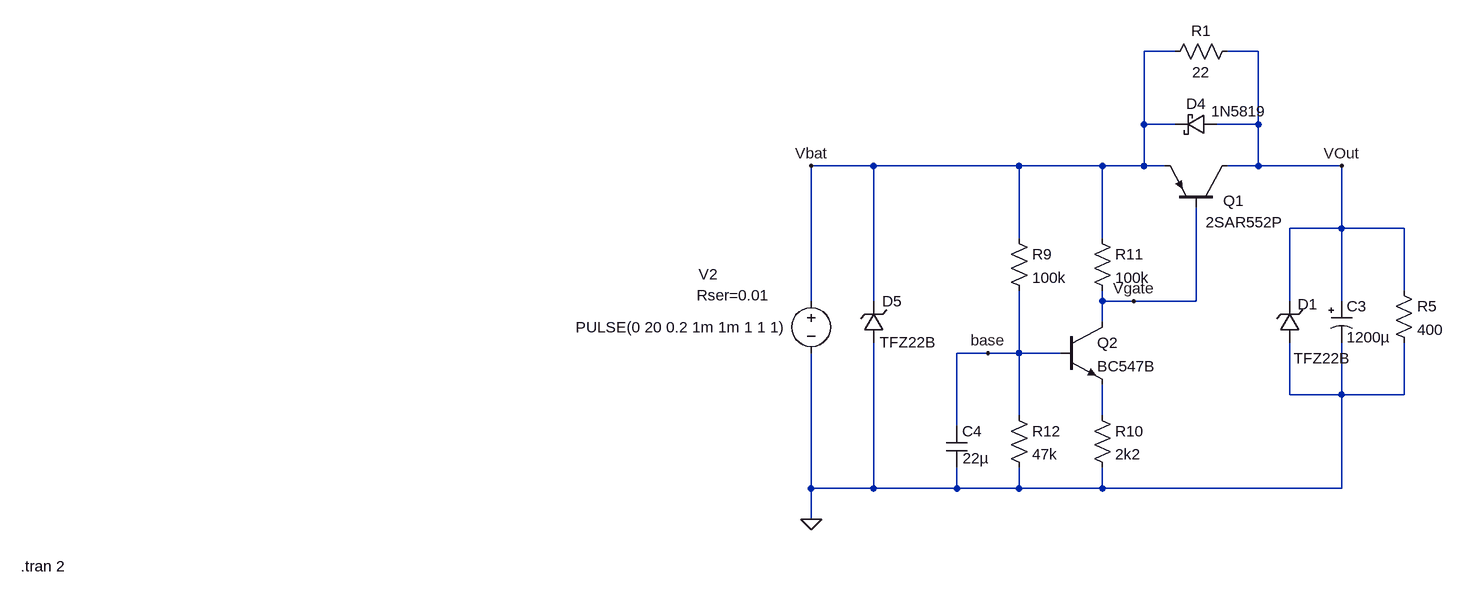
[diagram p0: schematic inrushLimiter_muteOut.asc]
inrushLimiter_muteOut.asc, the LTspice schematic file:
Version 4
SHEET 1 2212 680
WIRE 1392 -672 1344 -672
WIRE 1520 -672 1472 -672
WIRE 1344 -560 1344 -672
WIRE 1392 -560 1344 -560
WIRE 1520 -560 1520 -672
WIRE 1520 -560 1456 -560
WIRE 928 -496 832 -496
WIRE 1152 -496 928 -496
WIRE 1280 -496 1152 -496
WIRE 1344 -496 1344 -560
WIRE 1344 -496 1280 -496
WIRE 1376 -496 1344 -496
WIRE 1520 -496 1520 -560
WIRE 1520 -496 1472 -496
WIRE 1648 -496 1520 -496
WIRE 1648 -400 1648 -496
WIRE 1648 -400 1568 -400
WIRE 1744 -400 1648 -400
WIRE 1152 -384 1152 -496
WIRE 1280 -384 1280 -496
WIRE 1744 -304 1744 -400
WIRE 832 -288 832 -496
WIRE 928 -288 928 -496
WIRE 1280 -288 1280 -304
WIRE 1328 -288 1280 -288
WIRE 1424 -288 1424 -432
WIRE 1424 -288 1328 -288
WIRE 1568 -288 1568 -400
WIRE 1648 -288 1648 -400
WIRE 1280 -256 1280 -288
WIRE 1104 -208 1056 -208
WIRE 1152 -208 1152 -304
WIRE 1152 -208 1104 -208
WIRE 1216 -208 1152 -208
WIRE 1568 -144 1568 -224
WIRE 1648 -144 1648 -224
WIRE 1648 -144 1568 -144
WIRE 1744 -144 1744 -224
WIRE 1744 -144 1648 -144
WIRE 1152 -112 1152 -208
WIRE 1280 -112 1280 -160
WIRE 1056 -96 1056 -208
WIRE 832 0 832 -208
WIRE 928 0 928 -224
WIRE 928 0 832 0
WIRE 1056 0 1056 -32
WIRE 1056 0 928 0
WIRE 1152 0 1152 -32
WIRE 1152 0 1056 0
WIRE 1280 0 1280 -32
WIRE 1280 0 1152 0
WIRE 1648 0 1648 -144
WIRE 1648 0 1280 0
WIRE 832 48 832 0
FLAG 832 48 0
FLAG 832 -496 Vbat
FLAG 1648 -496 VOut
FLAG 1328 -288 Vgate
FLAG 1104 -208 base
SYMBOL polcap 1632 -288 R0
SYMATTR InstName C3
SYMATTR Value 1200µ
SYMBOL res 1728 -320 R0
SYMATTR InstName R5
SYMATTR Value 400
SYMBOL voltage 832 -304 R0
WINDOW 0 -173 -25 Left 2
WINDOW 3 -362 56 Left 2
WINDOW 123 0 0 Left 0
WINDOW 39 -176 7 Left 2
SYMATTR InstName V2
SYMATTR Value PULSE(0 20 0.2 1m 1m 1 1 1)
SYMATTR SpiceLine Rser=0.01
SYMBOL res 1136 -400 R0
SYMATTR InstName R9
SYMATTR Value 100k
SYMBOL res 1264 -128 R0
SYMATTR InstName R10
SYMATTR Value 2k2
SYMBOL npn 1216 -256 R0
SYMATTR InstName Q2
SYMATTR Value BC547B
SYMBOL res 1264 -400 R0
SYMATTR InstName R11
SYMATTR Value 100k
SYMBOL res 1136 -128 R0
SYMATTR InstName R12
SYMATTR Value 47k
SYMBOL schottky 1456 -576 R90
WINDOW 0 0 32 VBottom 2
WINDOW 3 -20 -34 VTop 2
SYMATTR InstName D4
SYMATTR Value 1N5819
SYMATTR Description Diode
SYMATTR Type diode
SYMBOL cap 1040 -96 R0
WINDOW 3 25 50 Left 2
SYMATTR Value 22µ
SYMATTR InstName C4
SYMBOL zener 944 -224 R180
WINDOW 0 -28 64 Left 2
WINDOW 3 -81 1 Left 2
SYMATTR InstName D5
SYMATTR Value TFZ22B
SYMATTR Type tvsdiode
SYMBOL zener 1584 -224 R180
WINDOW 0 -27 59 Left 2
WINDOW 3 -78 -24 Left 2
SYMATTR InstName D1
SYMATTR Value TFZ22B
SYMATTR Type tvsdiode
SYMBOL pnp 1472 -432 M270
WINDOW 0 10 6 VLeft 2
WINDOW 3 -23 33 VLeft 2
SYMATTR InstName Q1
SYMATTR Value 2SAR552P
SYMBOL res 1488 -688 R90
WINDOW 0 0 56 VBottom 2
WINDOW 3 32 56 VTop 2
SYMATTR InstName R1
SYMATTR Value 22
TEXT -384 120 Left 2 !.tran 2

The netlist it stands for:
* inrushLimiter_muteOut.asc
C3 VOut 0 1200µ
R5 VOut 0 400
V2 Vbat 0 PULSE(0 20 0.2 1m 1m 1 1 1) Rser=0.01
R9 Vbat base 100k
R10 N001 0 2k2
Q2 Vgate base N001 0 BC547B
R11 Vbat Vgate 100k
R12 base 0 47k
D4 VOut Vbat 1N5819
C4 base 0 22µ
D5 0 Vbat TFZ22B
D1 0 VOut TFZ22B
Q1 VOut Vgate Vbat 0 2SAR552P
R1 VOut Vbat 22
.model D D
.lib standard.dio
.model NPN NPN
.model PNP PNP
.lib standard.bjt
.tran 2
.backanno
.end